# EAGLE schematic schematic (EAGLE 9.6.2)
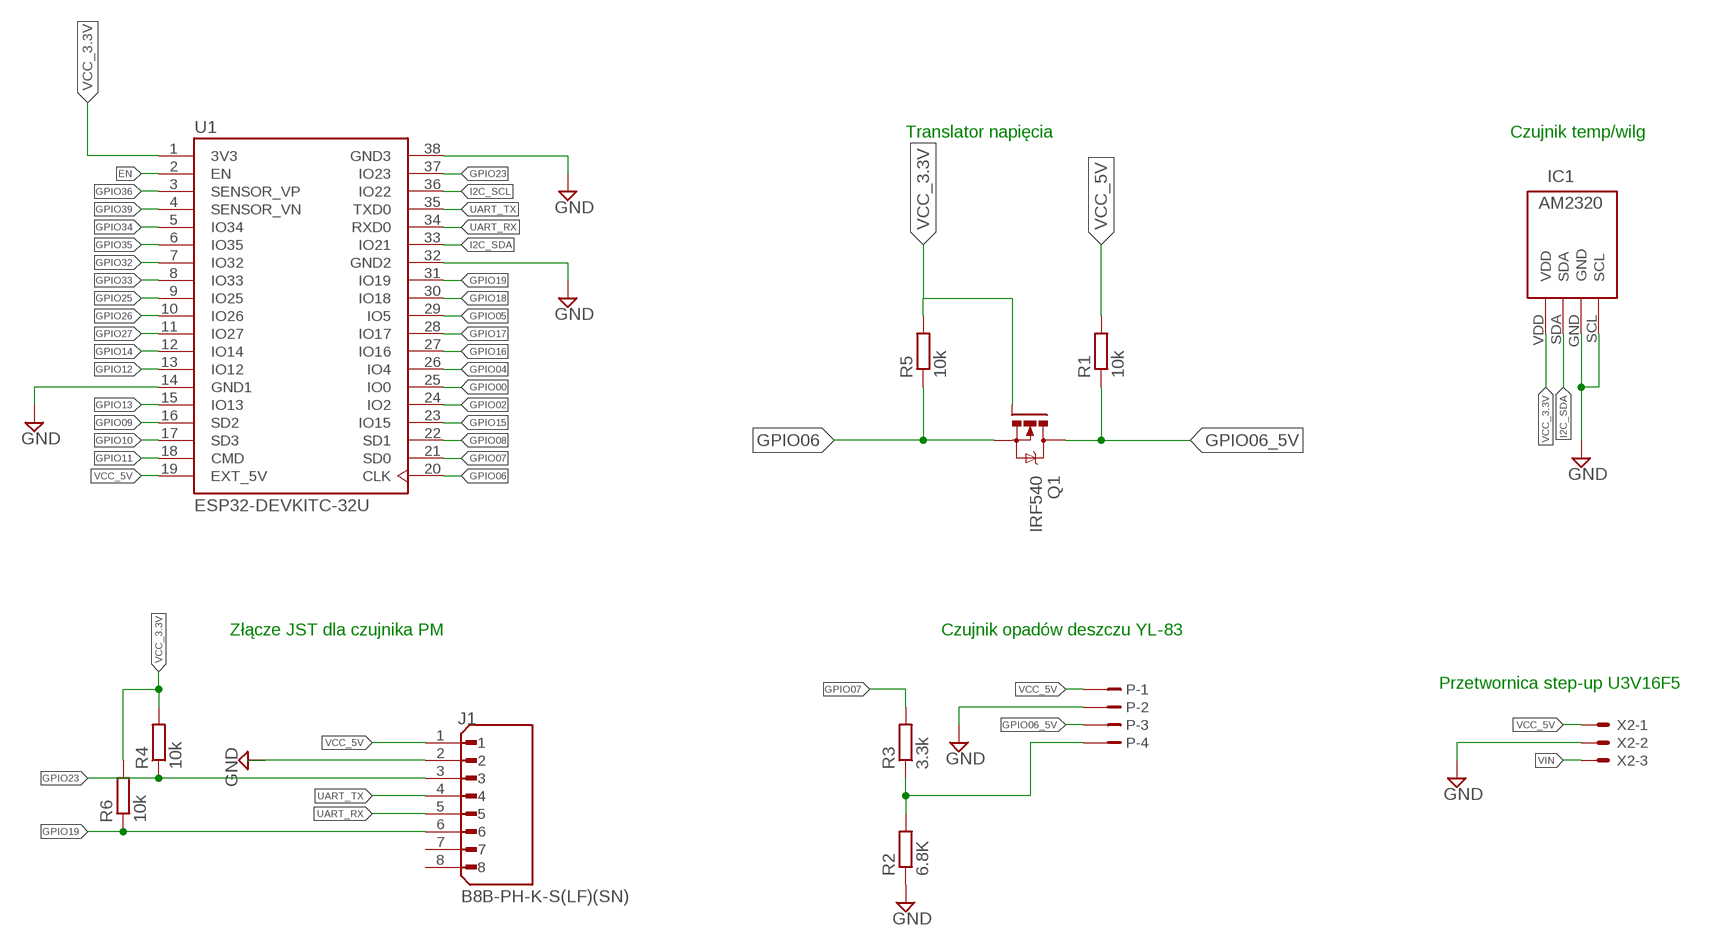
[diagram p0: schematic, sheet 1]

## Parts
IC1  AM2320  [AM2320]
J1  B8B-PH-K-S(LF)(SN)  [JST_B8B-PH-K-S(LF)(SN)]
P  B4B-ZR  [B4B-ZR]
Q1  IRF540  [TO220BV]
R1  10k  R-EU_0204/2V  [0204V]
R2  6.8K  R-EU_0204/2V  [0204V]
R3  3.3k  R-EU_0204/2V  [0204V]
R4  10k  R-EU_0204/2V  [0204V]
R5  10k  R-EU_0204/2V  [0204V]
R6  10k  R-EU_0204/2V  [0204V]
U1  ESP32-DEVKITC-32U  [MODULE_ESP32-DEVKITC-32U]
X2  22-23-2031  [22-23-2031]

## Nets
EN: U1.2(EN)
GND: IC1.GND IC1.SCL J1.2 P.2 R2.1 U1.14(GND1) U1.32(GND2) U1.38(GND3) X2.2
GPIO00: U1.25(IO0)
GPIO02: U1.24(IO2)
GPIO04: U1.26(IO4)
GPIO05: U1.29(IO5)
GPIO06: Q1.S R5.1 U1.20(CLK)
GPIO06_5V: P.3 Q1.D R1.1
GPIO07: R3.2 U1.21(SD0)
GPIO08: U1.22(SD1)
GPIO09: U1.16(SD2)
GPIO10: U1.17(SD3)
GPIO11: U1.18(CMD)
GPIO12: U1.13(IO12)
GPIO13: U1.15(IO13)
GPIO14: U1.12(IO14)
GPIO15: U1.23(IO15)
GPIO16: U1.27(IO16)
GPIO17: U1.28(IO17)
GPIO18: U1.30(IO18)
GPIO19: J1.6 R6.1 U1.31(IO19)
GPIO23: J1.3 R4.1 U1.37(IO23)
GPIO25: U1.9(IO25)
GPIO26: U1.10(IO26)
GPIO27: U1.11(IO27)
GPIO32: U1.7(IO32)
GPIO33: U1.8(IO33)
GPIO34: U1.5(IO34)
GPIO35: U1.6(IO35)
GPIO36: U1.3(SENSOR_VP)
GPIO39: U1.4(SENSOR_VN)
I2C_SCL: U1.36(IO22)
I2C_SDA: IC1.SDA U1.33(IO21)
N$2: P.4 R2.2 R3.1
UART_RX: J1.5 U1.34(RXD0)
UART_TX: J1.4 U1.35(TXD0)
VCC_3.3V: IC1.VDD Q1.G R4.2 R5.2 R6.2 U1.1(3V3)
VCC_5V: J1.1 P.1 R1.2 U1.19(EXT_5V) X2.1
VIN: X2.3
Unconnected: J1.7 J1.8

## Notes on the sheet
- Translator napięcia | Czujnik temp/wilg
- Złącze JST dla czujnika PM | Czujnik opadów deszczu YL-83
- Przetwornica step-up U3V16F5

## Library data of the parts
IC1 = am2320:AM2320: AM2320 Digital Temperature and Humidity Sensor
J1 = B8B-PH-K-S_LF__SN_:B8B-PH-K-S(LF)(SN): Check availability <https://pricing.snapeda.com/parts/B8B-PH-K-S%28LF%29%28SN%29/JST%20Sales/view-part?ref=eda>; AVAILABILITY: In Stock; CHECK_PRICES: https://www.snapeda.com/parts/B8B-PH-K-S(LF)(SN)/JST+Sales+America+Inc./view-part/?ref=eda; DESCRIPTION: Connector Header Through Hole 8 position 0.079 (2.00mm); MF: JST Sales; MP: B8B-PH-K-S(LF)(SN); PACKAGE: None; PRICE: None; SNAPEDA_LINK: https://www.snapeda.com/parts/B8B-PH-K-S(LF)(SN)/JST+Sales+America+Inc./view-part/?ref=snap
P = con-jst:?4B-ZR: ZH CONNECTOR 1.5 mm, 4 pin 1 row Source: http://www.jst.com .. eZH.pdf; MF: FARNELL; MPN: B4B-ZR(LF)(SN); OC_FARNELL: 1830916; OC_NEWARK: 37K9960
Q1 = transistor-power:IRF540: HEXFET Power MOSFET
R1-R6 = rcl:R-EU_: RESISTOR, European symbol; SPICEPREFIX: R
U1 = ESP32-DEVKITC-32U:ESP32-DEVKITC-32U; MANUFACTURER: Espressif Systems; MAXIMUM_PACKAGE_HEIGHT: N/A; PARTREV: V4; STANDARD: Manufacturer Recommendations
X2 = con-molex:22-23-2031: .100" (2.54mm) Center Header - 3 Pin; MF: MOLEX; MPN: 22-23-2031; OC_FARNELL: 1462950; OC_NEWARK: 30C0862